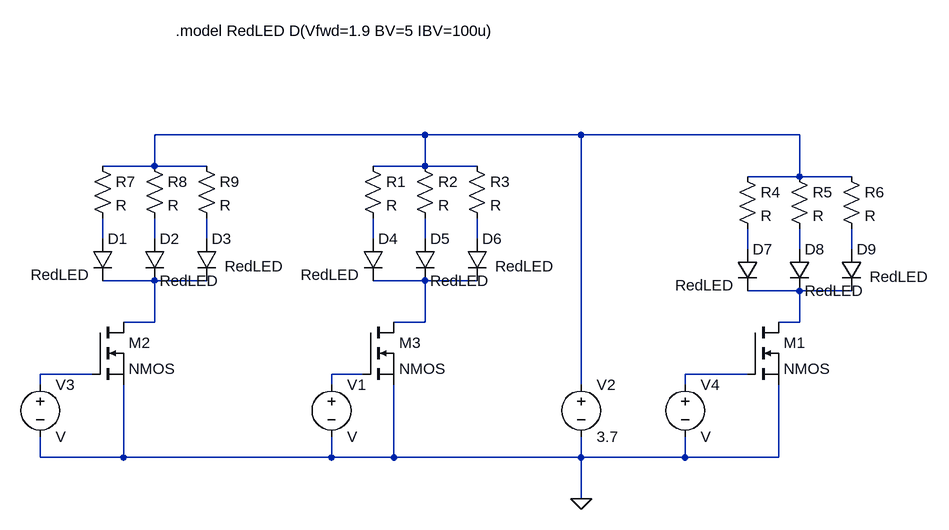
[diagram p0: schematic Circuit Simulation #1.asc]
Circuit Simulation #1.asc, the LTspice schematic file:
Version 4.1
SHEET 1 1012 680
WIRE 160 -736 -256 -736
WIRE 400 -736 160 -736
WIRE 736 -736 400 -736
WIRE -256 -688 -256 -736
WIRE -256 -688 -336 -688
WIRE -176 -688 -256 -688
WIRE 160 -688 160 -736
WIRE 160 -688 80 -688
WIRE 240 -688 160 -688
WIRE 736 -672 736 -736
WIRE 736 -672 656 -672
WIRE 816 -672 736 -672
WIRE -336 -576 -336 -608
WIRE -256 -576 -256 -608
WIRE -176 -576 -176 -608
WIRE 80 -576 80 -608
WIRE 160 -576 160 -608
WIRE 240 -576 240 -608
WIRE 656 -560 656 -592
WIRE 736 -560 736 -592
WIRE 816 -560 816 -592
WIRE -256 -512 -336 -512
WIRE -176 -512 -256 -512
WIRE 160 -512 80 -512
WIRE 240 -512 160 -512
WIRE 736 -496 656 -496
WIRE 816 -496 736 -496
WIRE -256 -448 -256 -512
WIRE -256 -448 -304 -448
WIRE 160 -448 160 -512
WIRE 160 -448 112 -448
WIRE 736 -448 736 -496
WIRE 736 -448 704 -448
WIRE -352 -368 -432 -368
WIRE 64 -368 16 -368
WIRE 656 -368 560 -368
WIRE -432 -352 -432 -368
WIRE 16 -352 16 -368
WIRE 400 -352 400 -736
WIRE 560 -352 560 -368
WIRE -432 -240 -432 -272
WIRE -304 -240 -304 -352
WIRE -304 -240 -432 -240
WIRE 16 -240 16 -272
WIRE 16 -240 -304 -240
WIRE 112 -240 112 -352
WIRE 112 -240 16 -240
WIRE 400 -240 400 -272
WIRE 400 -240 112 -240
WIRE 560 -240 560 -272
WIRE 560 -240 400 -240
WIRE 704 -240 704 -352
WIRE 704 -240 560 -240
WIRE 400 -176 400 -240
FLAG 400 -176 0
SYMBOL nmos 656 -448 R0
SYMATTR InstName M1
SYMBOL nmos -352 -448 R0
SYMATTR InstName M2
SYMBOL nmos 64 -448 R0
SYMATTR InstName M3
SYMBOL voltage 16 -368 R0
SYMATTR InstName V1
SYMBOL voltage 400 -368 R0
WINDOW 123 0 0 Left 0
WINDOW 39 0 0 Left 0
SYMATTR InstName V2
SYMATTR Value 3.7
SYMBOL voltage -432 -368 R0
SYMATTR InstName V3
SYMBOL voltage 560 -368 R0
SYMATTR InstName V4
SYMBOL res 64 -704 R0
SYMATTR InstName R1
SYMBOL res 144 -704 R0
SYMATTR InstName R2
SYMBOL res 224 -704 R0
SYMATTR InstName R3
SYMBOL res 640 -688 R0
SYMATTR InstName R4
SYMBOL res 720 -688 R0
SYMATTR InstName R5
SYMBOL res 800 -688 R0
SYMATTR InstName R6
SYMBOL res -352 -704 R0
SYMATTR InstName R7
SYMBOL res -272 -704 R0
SYMATTR InstName R8
SYMBOL res -192 -704 R0
SYMATTR InstName R9
SYMBOL diode -272 -576 R0
SYMATTR InstName D2
SYMATTR Value RedLED
SYMBOL diode -192 -576 R0
WINDOW 3 44 42 Left 2
SYMATTR InstName D3
SYMATTR Value RedLED
SYMBOL diode -352 -576 R0
WINDOW 3 -95 55 Left 2
SYMATTR InstName D1
SYMATTR Value RedLED
SYMBOL diode 64 -576 R0
WINDOW 3 -95 55 Left 2
SYMATTR InstName D4
SYMATTR Value RedLED
SYMBOL diode 144 -576 R0
SYMATTR InstName D5
SYMATTR Value RedLED
SYMBOL diode 224 -576 R0
WINDOW 3 44 42 Left 2
SYMATTR InstName D6
SYMATTR Value RedLED
SYMBOL diode 640 -560 R0
WINDOW 3 -95 55 Left 2
SYMATTR InstName D7
SYMATTR Value RedLED
SYMBOL diode 720 -560 R0
SYMATTR InstName D8
SYMATTR Value RedLED
SYMBOL diode 800 -560 R0
WINDOW 3 44 42 Left 2
SYMATTR InstName D9
SYMATTR Value RedLED
TEXT -224 -896 Left 2 !.model RedLED D(Vfwd=1.9 BV=5 IBV=100u)

The netlist it stands for:
* Circuit Simulation #1.asc
M1 N013 N016 0 0 NMOS
M2 N011 N014 0 0 NMOS
M3 N012 N015 0 0 NMOS
V1 N015 0 V
V2 N001 0 3.7
V3 N014 0 V
V4 N016 0 V
R1 N001 N005 R
R2 N001 N006 R
R3 N001 N007 R
R4 N001 N008 R
R5 N001 N009 R
R6 N001 N010 R
R7 N001 N002 R
R8 N001 N003 R
R9 N001 N004 R
D2 N003 N011 RedLED
D3 N004 N011 RedLED
D1 N002 N011 RedLED
D4 N005 N012 RedLED
D5 N006 N012 RedLED
D6 N007 N012 RedLED
D7 N008 N013 RedLED
D8 N009 N013 RedLED
D9 N010 N013 RedLED
.model D D
.lib standard.dio
.model NMOS NMOS
.model PMOS PMOS
.lib standard.mos
.model RedLED D(Vfwd=1.9 BV=5 IBV=100u)
.backanno
.end